# Altium project مبدل.PrjPcb
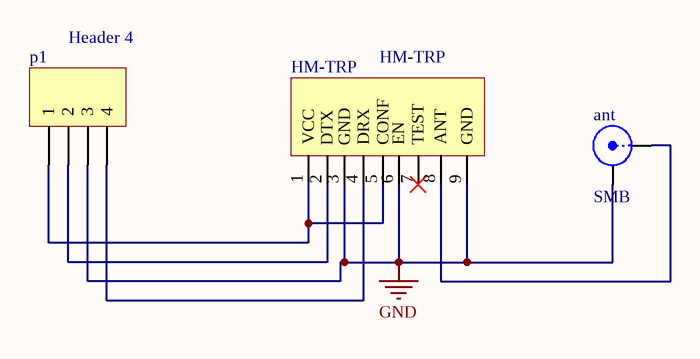
[diagram p0: Sheet1.SchDoc]
1 sheet, 3 parts. Net scope: global (net labels, ports and power ports of the same name join across sheets).
Board file: PCB1.PcbDoc

## Sheet Sheet1.SchDoc
size B

### Parts
ant  SMB  [SMB_V-RJ45]
HM-TRP  HM-TRP  [PCBComponent_1]
p1  Header 4  [HDR1X4]

### Nets
GND: ant.2(Y) HM-TRP.3(GND) HM-TRP.6(EN) HM-TRP.9(GND) p1.3
Netant_1: ant.1(X) HM-TRP.8(ANT)
NetHM-TRP_1: HM-TRP.1(VCC) HM-TRP.5(CONF) p1.1
NetHM-TRP_2: HM-TRP.2(DTX) p1.2
NetHM-TRP_4: HM-TRP.4(DRX) p1.4

Not connected (* = marked no-connect by the designer): HM-TRP 7(TEST)*

### Library data of the parts
ant = SMB: SMB Straight Connector; LatestRevisionDate: 17-Jul-2002; LatestRevisionNote: Re-released for DXP Platform.; Publisher: Altium Limited
HM-TRP = Component_1
p1 = Header 4: Header, 4-Pin; LatestRevisionDate: 17-Jul-2002; LatestRevisionNote: Re-released for DXP Platform.; Publisher: Altium Limited